# EAGLE schematic mains-protection-panel (EAGLE 6.2)
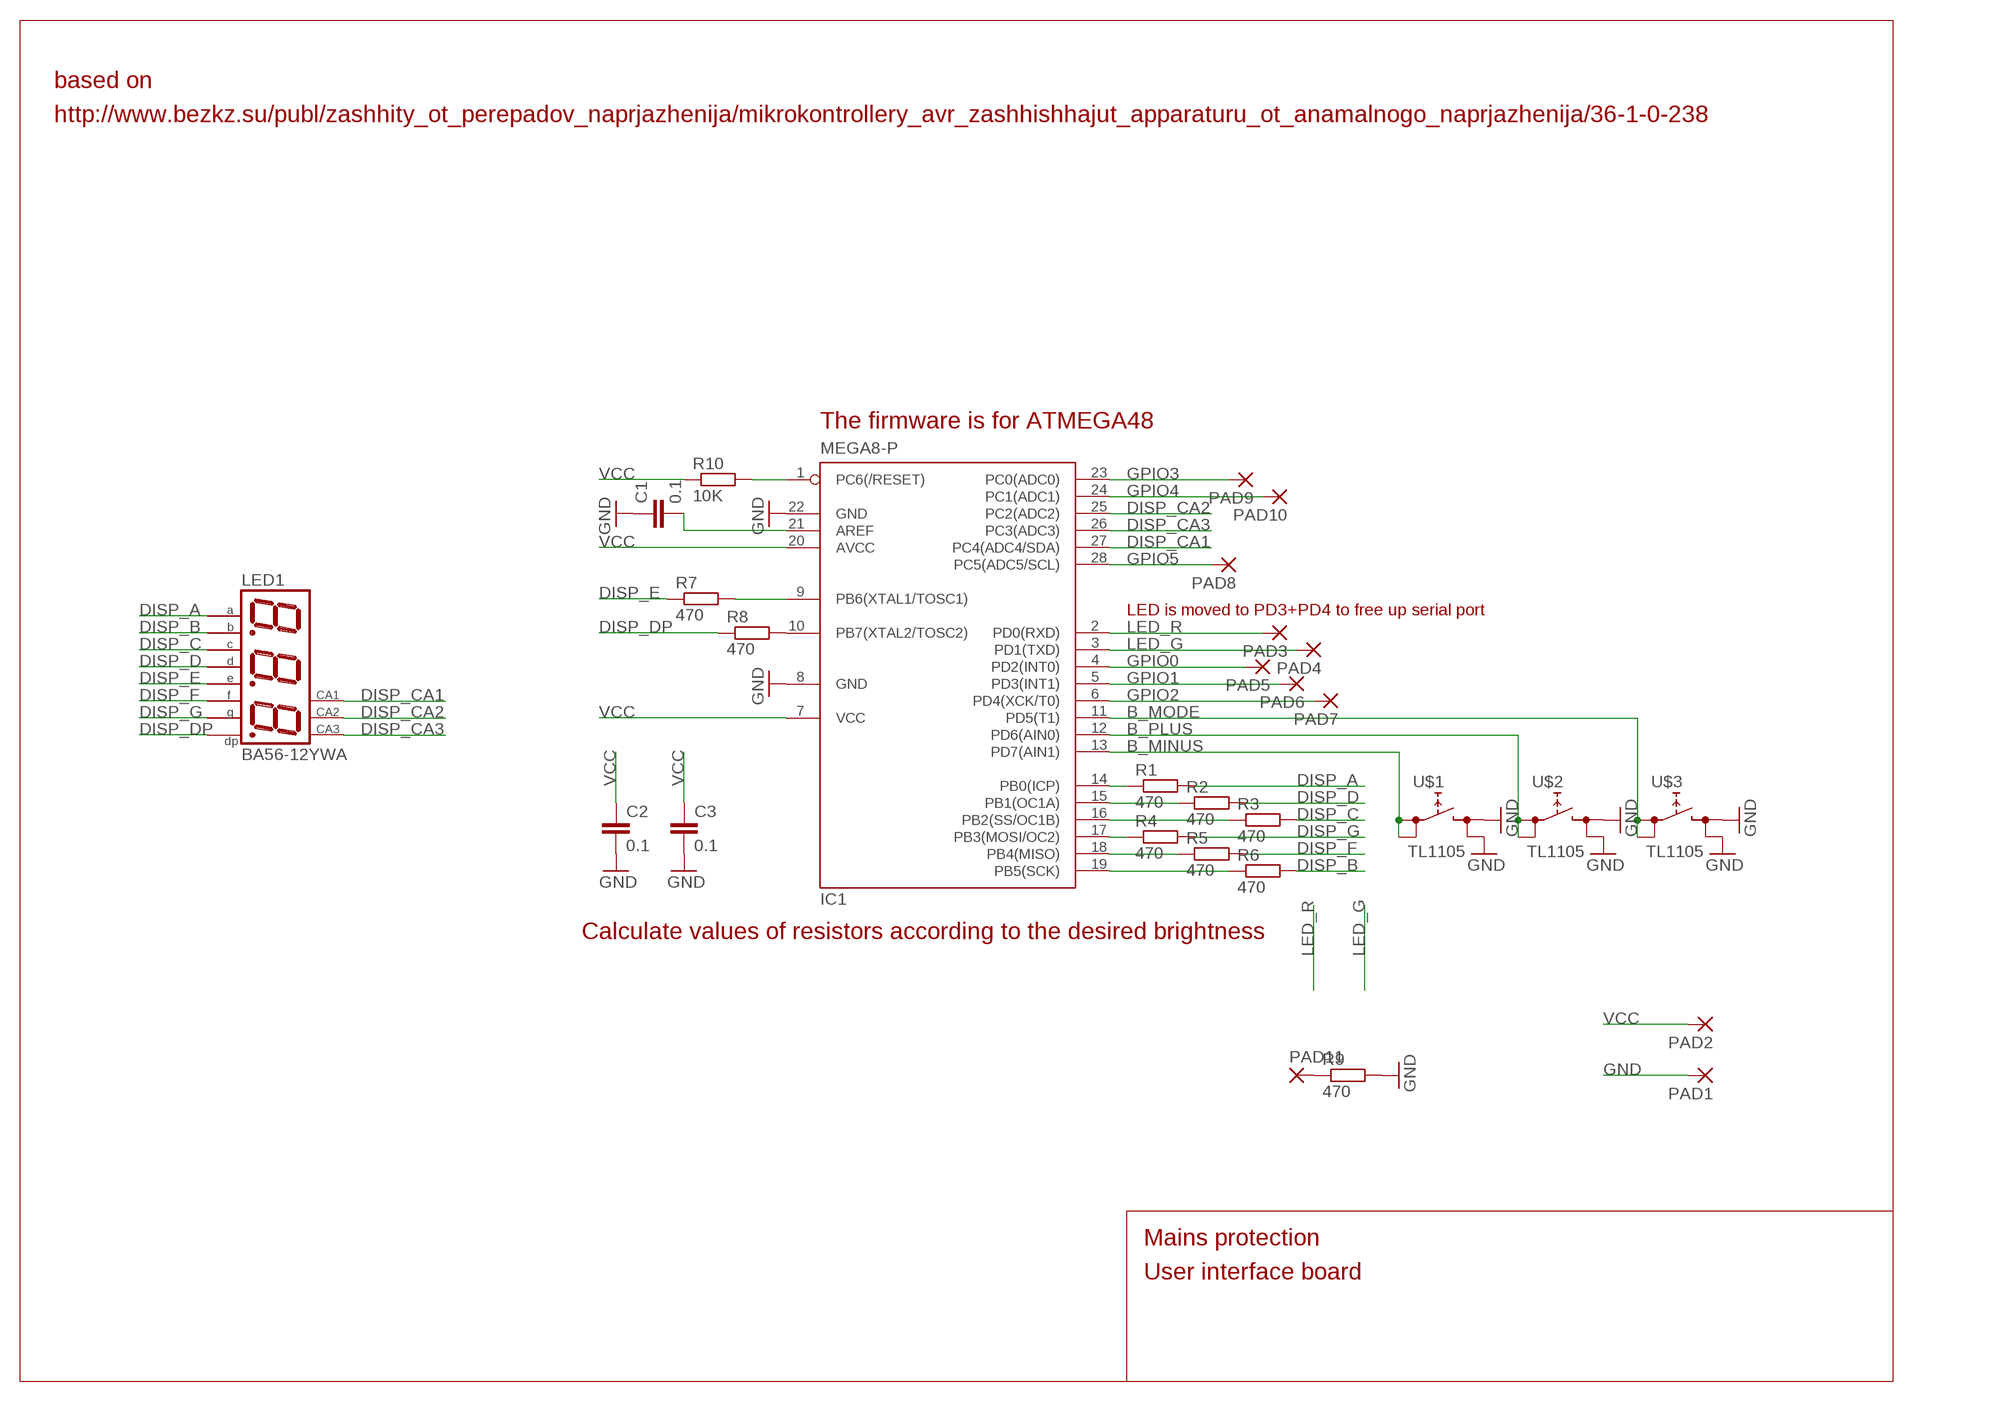
[diagram p0: schematic, sheet 1]

## Parts
C1  0.1  C-EUC1206  [C1206]
C2  0.1  C-EUC1206  [C1206]
C3  0.1  C-EUC1206  [C1206]
IC1  MEGA8-P  [DIL28-3]
LED1  BA56-12YWA  [BX56-12]
PAD1  1,6/0,8  [1,6/0,8]
PAD2  1,6/0,8  [1,6/0,8]
PAD3  1,6/0,8  [1,6/0,8]
PAD4  1,6/0,8  [1,6/0,8]
PAD5  1,6/0,8  [1,6/0,8]
PAD6  1,6/0,8  [1,6/0,8]
PAD7  1,6/0,8  [1,6/0,8]
PAD8  1,6/0,8  [1,6/0,8]
PAD9  1,6/0,8  [1,6/0,8]
PAD10  1,6/0,8  [1,6/0,8]
PAD11  1,6/0,8  [1,6/0,8]
R1  470  R-EU_R0805  [R0805]
R2  470  R-EU_R0805  [R0805]
R3  470  R-EU_R0805  [R0805]
R4  470  R-EU_R0805  [R0805]
R5  470  R-EU_R0805  [R0805]
R6  470  R-EU_R0805  [R0805]
R7  470  R-EU_R0805  [R0805]
R8  470  R-EU_R0805  [R0805]
R9  470  R-EU_R0805  [R0805]
R10  10K  R-EU_R0805  [R0805]
U$1  TL1105  [LARGE]
U$2  TL1105  [LARGE]
U$3  TL1105  [LARGE]

## Nets
B_MINUS: IC1.13(PD7(AIN1)) U$1.P$1 U$1.P$2
B_MODE: IC1.11(PD5(T1)) U$3.P$1 U$3.P$2
B_PLUS: IC1.12(PD6(AIN0)) U$2.P$1 U$2.P$2
DISP_A: LED1.11(A) R1.2
DISP_B: LED1.7(B) R6.2
DISP_C: LED1.4(C) R3.2
DISP_CA1: IC1.27(PC4(ADC4/SDA)) LED1.12(CA)
DISP_CA2: IC1.25(PC2(ADC2)) LED1.9(CA)
DISP_CA3: IC1.26(PC3(ADC3)) LED1.8(CA)
DISP_D: LED1.2(D) R2.2
DISP_DP: LED1.3(DP) R8.1
DISP_E: LED1.1(E) R7.1
DISP_F: LED1.10(F) R5.2
DISP_G: LED1.5(G) R4.2
GND: C1.1 C2.2 C3.2 IC1.8(GND) IC1.22(GND) PAD1.1(P) R9.2 U$1.P$3 U$1.P$4 U$2.P$3 U$2.P$4 U$3.P$3 U$3.P$4
GPIO0: IC1.4(PD2(INT0)) PAD5.1(P)
GPIO1: IC1.5(PD3(INT1)) PAD6.1(P)
GPIO2: IC1.6(PD4(XCK/T0)) PAD7.1(P)
GPIO3: IC1.23(PC0(ADC0)) PAD9.1(P)
GPIO4: IC1.24(PC1(ADC1)) PAD10.1(P)
GPIO5: IC1.28(PC5(ADC5/SCL)) PAD8.1(P)
LED_G: IC1.3(PD1(TXD)) PAD4.1(P)
LED_R: IC1.2(PD0(RXD)) PAD3.1(P)
N$1: IC1.1(PC6(/RESET)) R10.2
N$2: PAD11.1(P) R9.1
N$4: IC1.14(PB0(ICP)) R1.1
N$5: IC1.15(PB1(OC1A)) R2.1
N$6: IC1.16(PB2(SS/OC1B)) R3.1
N$7: IC1.17(PB3(MOSI/OC2)) R4.1
N$8: IC1.18(PB4(MISO)) R5.1
N$9: IC1.19(PB5(SCK)) R6.1
N$10: IC1.9(PB6(XTAL1/TOSC1)) R7.2
N$11: IC1.10(PB7(XTAL2/TOSC2)) R8.2
N$12: C1.2 IC1.21(AREF)
VCC: C2.1 C3.1 IC1.7(VCC) IC1.20(AVCC) PAD2.1(P) R10.1

## Notes on the sheet
- based on
- http://www.bezkz.su/publ/zashhity_ot_perepadov_naprjazhenija/mikrokontrollery_avr_zashhishhajut_apparaturu_ot_anamalnogo_naprjazhenija/36-1-0-238
- The firmware is for ATMEGA48
- LED is moved to PD3+PD4 to free up serial port
- Calculate values of resistors according to the desired brightness
- Mains protection
- User interface board

## Library data of the parts
C1-C3 = rcl:C-EU: CAPACITOR, European symbol
IC1 = atmel:MEGA8-P: MICROCONTROLLER 8 Kbytes FLASH, 1 kbytes SRAM, 512 bytes EEPROM, USART, 4-channel 10 bit ADC, 2-channel 8 bit ADC Pin compatible with Atmega48, ATMega88, ATMega168 Source: avr.lbr; OC_FARNELL: unknown; OC_NEWARK: unknown
LED1 = display-kingbright:B?56-12*WA: 14.22mm (0.56INCH) THREE DIGIT NUMERIC DISPLAY Source: http://www.kingbright.com .. BA56-11EWA(Ver1189474895.pdf; OC_FARNELL: unknown; OC_NEWARK: unknown
PAD1-PAD11 = wirepad:1,6/0,8: THROUGH-HOLE PAD
R1-R10 = rcl:R-EU_: RESISTOR, European symbol
U$1-U$3 = switch:TL1105: STD